# Altium schematic sheet QS30-Main.SchDoc
size A4
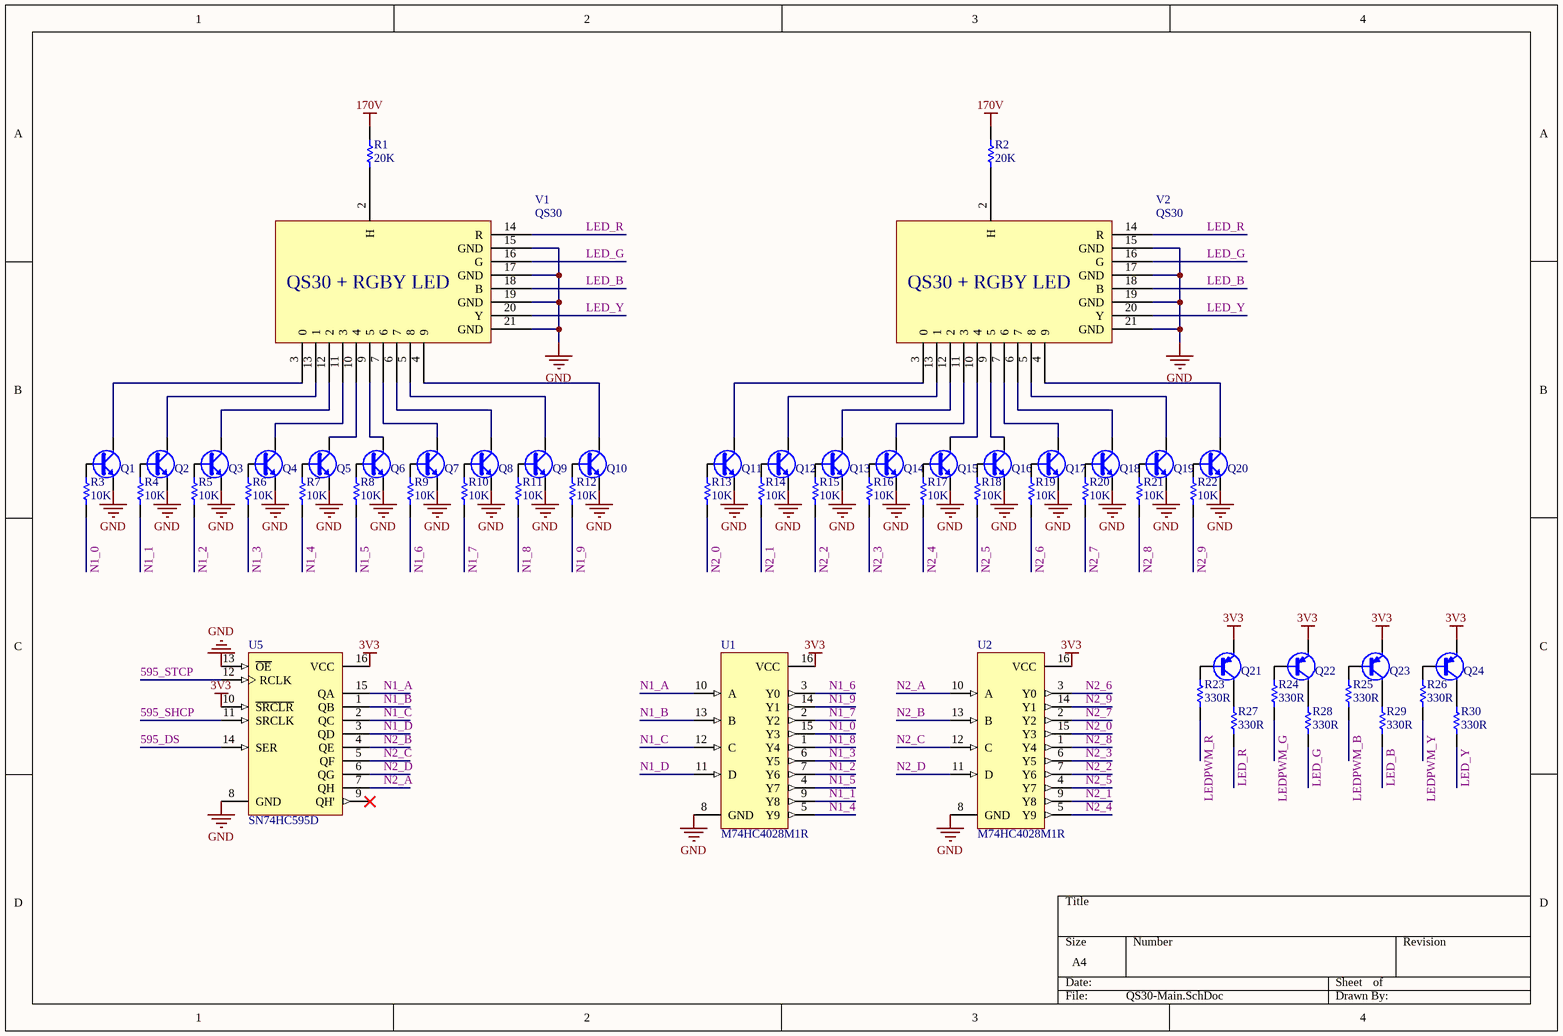
[diagram p0: QS30-Main.SchDoc]

## Parts
Q1  MMBTA42  [SOT-23B_L]  (value not drawn)
Q2  MMBTA42  [SOT-23B_L]  (value not drawn)
Q3  MMBTA42  [SOT-23B_L]  (value not drawn)
Q4  MMBTA42  [SOT-23B_L]  (value not drawn)
Q5  MMBTA42  [SOT-23B_L]  (value not drawn)
Q6  MMBTA42  [SOT-23B_L]  (value not drawn)
Q7  MMBTA42  [SOT-23B_L]  (value not drawn)
Q8  MMBTA42  [SOT-23B_L]  (value not drawn)
Q9  MMBTA42  [SOT-23B_L]  (value not drawn)
Q10  MMBTA42  [SOT-23B_L]  (value not drawn)
Q11  MMBTA42  [SOT-23B_L]  (value not drawn)
Q12  MMBTA42  [SOT-23B_L]  (value not drawn)
Q13  MMBTA42  [SOT-23B_L]  (value not drawn)
Q14  MMBTA42  [SOT-23B_L]  (value not drawn)
Q15  MMBTA42  [SOT-23B_L]  (value not drawn)
Q16  MMBTA42  [SOT-23B_L]  (value not drawn)
Q17  MMBTA42  [SOT-23B_L]  (value not drawn)
Q18  MMBTA42  [SOT-23B_L]  (value not drawn)
Q19  MMBTA42  [SOT-23B_L]  (value not drawn)
Q20  MMBTA42  [SOT-23B_L]  (value not drawn)
Q21  9012 8550  [SOT-23]  (value not drawn)
Q22  9012 8550  [SOT-23]  (value not drawn)
Q23  9012 8550  [SOT-23]  (value not drawn)
Q24  9012 8550  [SOT-23]  (value not drawn)
R1  value 20K  [6-0805_N]  (hidden comment: Res1)
R2  value 20K  [6-0805_N]  (hidden comment: Res1)
R3  value 10K  [6-0805_N]  (hidden comment: Res1)
R4  value 10K  [6-0805_N]  (hidden comment: Res1)
R5  value 10K  [6-0805_N]  (hidden comment: Res1)
R6  value 10K  [6-0805_N]  (hidden comment: Res1)
R7  value 10K  [6-0805_N]  (hidden comment: Res1)
R8  value 10K  [6-0805_N]  (hidden comment: Res1)
R9  value 10K  [6-0805_N]  (hidden comment: Res1)
R10  value 10K  [6-0805_N]  (hidden comment: Res1)
R11  value 10K  [6-0805_N]  (hidden comment: Res1)
R12  value 10K  [6-0805_N]  (hidden comment: Res1)
R13  value 10K  [6-0805_N]  (hidden comment: Res1)
R14  value 10K  [6-0805_N]  (hidden comment: Res1)
R15  value 10K  [6-0805_N]  (hidden comment: Res1)
R16  value 10K  [6-0805_N]  (hidden comment: Res1)
R17  value 10K  [6-0805_N]  (hidden comment: Res1)
R18  value 10K  [6-0805_N]  (hidden comment: Res1)
R19  value 10K  [6-0805_N]  (hidden comment: Res1)
R20  value 10K  [6-0805_N]  (hidden comment: Res1)
R21  value 10K  [6-0805_N]  (hidden comment: Res1)
R22  value 10K  [6-0805_N]  (hidden comment: Res1)
R23  value 330R  [6-0805_N]  (hidden comment: Res1)
R24  value 330R  [6-0805_N]  (hidden comment: Res1)
R25  value 330R  [6-0805_N]  (hidden comment: Res1)
R26  value 330R  [6-0805_N]  (hidden comment: Res1)
R27  value 330R  [6-0805_N]  (hidden comment: Res1)
R28  value 330R  [6-0805_N]  (hidden comment: Res1)
R29  value 330R  [6-0805_N]  (hidden comment: Res1)
R30  value 330R  [6-0805_N]  (hidden comment: Res1)
U1  M74HC4028M1R  [SO16_N]
U2  M74HC4028M1R  [SO16_N]
U5  SN74HC595D  [D016_N]
V1  QS30  [QS30]
V2  QS30  [QS30]

## Nets
3V3: Q21.2(e) Q22.2(e) Q23.2(e) Q24.2(e) U1.16(VCC) U2.16(VCC) U5.10(~{SRCLR}) U5.16(VCC)
170V: R1.1 R2.1
GND: Q1.2(E) Q2.2(E) Q3.2(E) Q4.2(E) Q5.2(E) Q6.2(E) Q7.2(E) Q8.2(E) Q9.2(E) Q10.2(E) Q11.2(E) Q12.2(E) Q13.2(E) Q14.2(E) Q15.2(E) Q16.2(E) Q17.2(E) Q18.2(E) Q19.2(E) Q20.2(E) U1.8(GND) U2.8(GND) U5.8(GND) U5.13(~{OE}) V1.15(GND) V1.17(GND) V1.19(GND) V1.21(GND) V2.15(GND) V2.17(GND) V2.19(GND) V2.21(GND)
595_DS: U5.14(SER)
595_SHCP: U5.11(SRCLK)
595_STCP: U5.12(RCLK)
LED_B: R29.1 V1.18(B) V2.18(B)
LED_G: R28.1 V1.16(G) V2.16(G)
LED_R: R27.1 V1.14(R) V2.14(R)
LED_Y: R30.1 V1.20(Y) V2.20(Y)
LEDPWM_B: R25.1
LEDPWM_G: R24.1
LEDPWM_R: R23.1
LEDPWM_Y: R26.1
N1_0: R3.2 U1.15(Y3)
N1_1: R4.2 U1.9(Y8)
N1_2: R5.2 U1.7(Y6)
N1_3: R6.2 U1.6(Y5)
N1_4: R7.2 U1.5(Y9)
N1_5: R8.2 U1.4(Y7)
N1_6: R9.2 U1.3(Y0)
N1_7: R10.2 U1.2(Y2)
N1_8: R11.2 U1.1(Y4)
N1_9: R12.2 U1.14(Y1)
N1_A: U1.10(A) U5.15(QA)
N1_B: U1.13(B) U5.1(QB)
N1_C: U1.12(C) U5.2(QC)
N1_D: U1.11(D) U5.3(QD)
N2_0: R13.2 U2.15(Y3)
N2_1: R14.2 U2.9(Y8)
N2_2: R15.2 U2.7(Y6)
N2_3: R16.2 U2.6(Y5)
N2_4: R17.2 U2.5(Y9)
N2_5: R18.2 U2.4(Y7)
N2_6: R19.2 U2.3(Y0)
N2_7: R20.2 U2.2(Y2)
N2_8: R21.2 U2.1(Y4)
N2_9: R22.2 U2.14(Y1)
N2_A: U2.10(A) U5.7(QH)
N2_B: U2.13(B) U5.4(QE)
N2_C: U2.12(C) U5.5(QF)
N2_D: U2.11(D) U5.6(QG)
NetQ1_1: Q1.1(B) R3.1
NetQ1_3: Q1.3(C) V1.3(0)
NetQ2_1: Q2.1(B) R4.1
NetQ2_3: Q2.3(C) V1.13(1)
NetQ3_1: Q3.1(B) R5.1
NetQ3_3: Q3.3(C) V1.12(2)
NetQ4_1: Q4.1(B) R6.1
NetQ4_3: Q4.3(C) V1.11(3)
NetQ5_1: Q5.1(B) R7.1
NetQ5_3: Q5.3(C) V1.10(4)
NetQ6_1: Q6.1(B) R8.1
NetQ6_3: Q6.3(C) V1.9(5)
NetQ7_1: Q7.1(B) R9.1
NetQ7_3: Q7.3(C) V1.7(6)
NetQ8_1: Q8.1(B) R10.1
NetQ8_3: Q8.3(C) V1.6(7)
NetQ9_1: Q9.1(B) R11.1
NetQ9_3: Q9.3(C) V1.5(8)
NetQ10_1: Q10.1(B) R12.1
NetQ10_3: Q10.3(C) V1.4(9)
NetQ11_1: Q11.1(B) R13.1
NetQ11_3: Q11.3(C) V2.3(0)
NetQ12_1: Q12.1(B) R14.1
NetQ12_3: Q12.3(C) V2.13(1)
NetQ13_1: Q13.1(B) R15.1
NetQ13_3: Q13.3(C) V2.12(2)
NetQ14_1: Q14.1(B) R16.1
NetQ14_3: Q14.3(C) V2.11(3)
NetQ15_1: Q15.1(B) R17.1
NetQ15_3: Q15.3(C) V2.10(4)
NetQ16_1: Q16.1(B) R18.1
NetQ16_3: Q16.3(C) V2.9(5)
NetQ17_1: Q17.1(B) R19.1
NetQ17_3: Q17.3(C) V2.7(6)
NetQ18_1: Q18.1(B) R20.1
NetQ18_3: Q18.3(C) V2.6(7)
NetQ19_1: Q19.1(B) R21.1
NetQ19_3: Q19.3(C) V2.5(8)
NetQ20_1: Q20.1(B) R22.1
NetQ20_3: Q20.3(C) V2.4(9)
NetQ21_1: Q21.1(b) R23.2
NetQ21_3: Q21.3(c) R27.2
NetQ22_1: Q22.1(b) R24.2
NetQ22_3: Q22.3(c) R28.2
NetQ23_1: Q23.1(b) R25.2
NetQ23_3: Q23.3(c) R29.2
NetQ24_1: Q24.1(b) R26.2
NetQ24_3: Q24.3(c) R30.2
NetR1_2: R1.2 V1.2(H)
NetR2_2: R2.2 V2.2(H)

Not connected (* = marked no-connect by the designer): U5 9(QH')*

## Notes on the sheet
- (in symbol QS30) QS30 + RGBY LED

## Library data of the parts
Q21-Q24 = 9012 8550: PNP
R1-R30 = Res1: Resistor; Published: 8-Jun-2000; LatestRevisionDate: 17-Jul-2002; LatestRevisionNote: Re-released for DXP Platform.; PackageReference: AXIAL-0.3; Publisher: Altium Limited; PackageDescription: Axial Device, Thru-Hole; 2 Leads; 0.3 in Pin Spacing
U1 U2 = M74HC4028M1R: BCD-to-Decimal Decoder; Published: 8-Jun-2000; LatestRevisionDate: 13-Apr-2006; LatestRevisionNote: IPC-7351 Footprint Added.; DatasheetVersion: Oct-1992; PackageVersion: May-1998; PackageReference: SO16; Publisher: Altium Limited; PackageDescription: 16-Pin Small Outline Integrated Circuit 1.27 mm Pitch; Code_IPC: SOIC127P600-16; ComponentLink1Description: Manufacturer Link; ComponentLink1URL: http://www.st.com/; ComponentLink2Description: Datasheet; ComponentLink2URL: http://www.st.com/stonline/products/literature/ds/1964/m74hc4028.pdf
U5 = SN74HC595D: 8-Bit Shift Register with 3-State Output Registers; Published: 8-Jun-2000; LatestRevisionDate: 13-Apr-2006; LatestRevisionNote: IPC-7351 Footprint Added.; DatasheetVersion: May-1997; PackageVersion: Jan-1998; PackageReference: D016; Publisher: Altium Limited; PackageDescription: 16-Pin Small Outline Integrated Circuit 1.27 mm Pitch; Code_IPC: SOIC127P600-16; ComponentLink1Description: Manufacturer Link; ComponentLink1URL: http://www.ti.com/; ComponentLink2Description: Datasheet; ComponentLink2URL: http://www-s.ti.com/sc/ds/sn74hc595.pdf